# Altium schematic sheet Esquematico.SchDoc
size A4
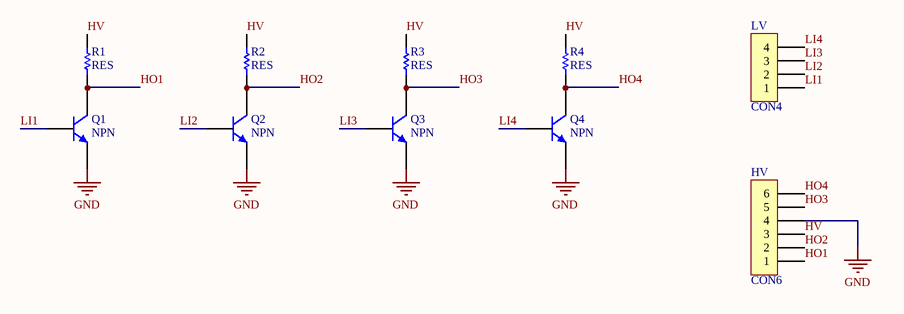
[diagram p0: Esquematico.SchDoc]

## Parts
HV  CON6  [SIP6]
LV  CON4  [SIP4]
Q1  NPN  [TO-226-AA]
Q2  NPN  [TO-226-AA]
Q3  NPN  [TO-226-AA]
Q4  NPN  [TO-226-AA]
R1  RES  [RES400]
R2  RES  [RES400]
R3  RES  [RES400]
R4  RES  [RES400]

## Nets
GND: HV.4 Q1.3(E) Q2.3(E) Q3.3(E) Q4.3(E)
HO1: HV.1 Q1.1(C) R1.1
HO2: HV.2 Q2.1(C) R2.1
HO3: HV.5 Q3.1(C) R3.1
HO4: HV.6 Q4.1(C) R4.1
HV: HV.3 R1.2 R2.2 R3.2 R4.2
LI1: LV.1 Q1.2(B)
LI2: LV.2 Q2.2(B)
LI3: LV.3 Q3.2(B)
LI4: LV.4 Q4.2(B)

## Library data of the parts
Q1-Q4 = NPN: NPN Bipolar Transistor; Published: 8-Jun-2000; LatestRevisionDate: 17-Jul-2002; LatestRevisionNote: Re-released for DXP Platform.; PackageReference: TO-226-AA; Publisher: Altium Limited; PackageDescription: TO, Flat Index; 3 In-Line, Axial Leads; Body Dia. 4.8mm; Leads 0.55 x 0.51 mm (max); Code_JEDEC: TO-226-AA